# EAGLE design Incubator (EAGLE 6.4)
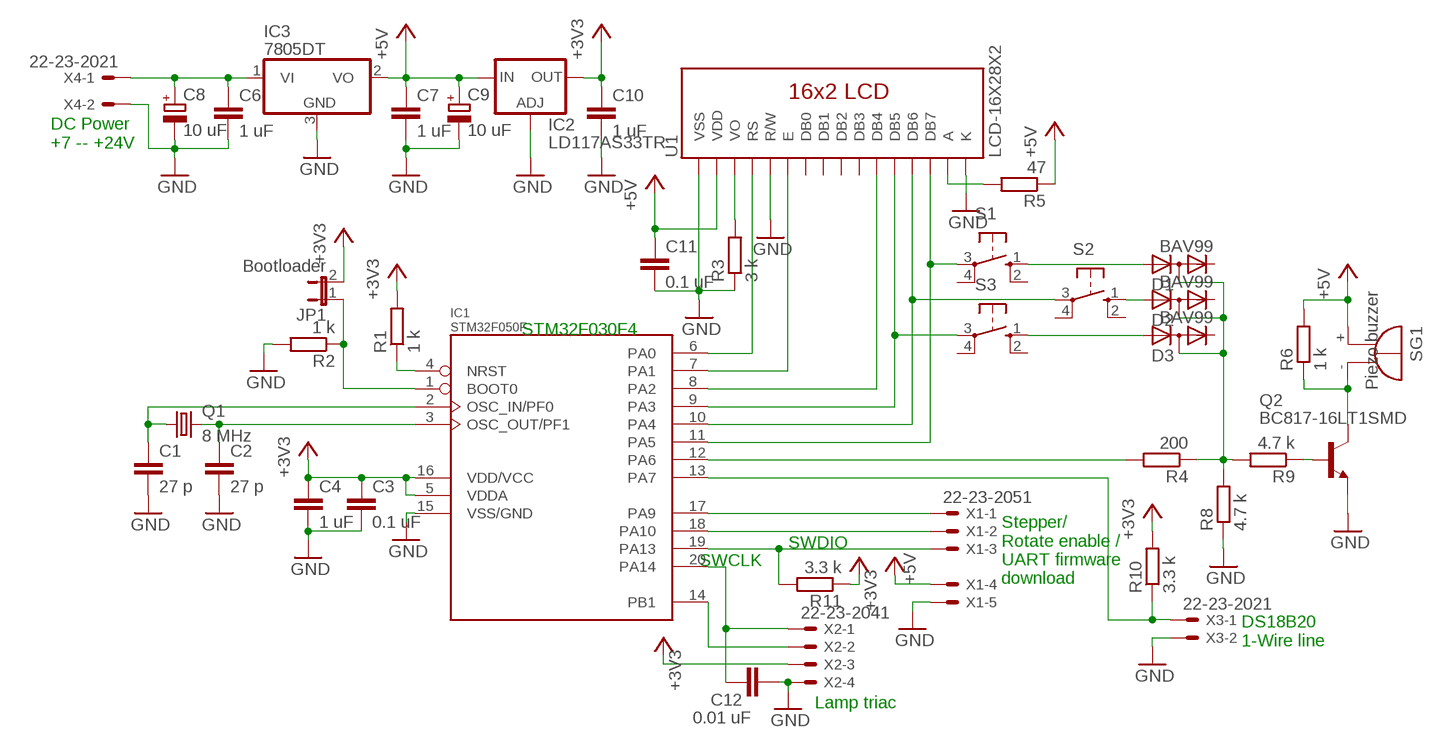
[diagram p0: schematic, sheet 1]

## Parts
C1  27 p  C-EUC0805  [C0805]
C2  27 p  C-EUC0805  [C0805]
C3  0.1 uF  C-EUC0805  [C0805]
C4  1 uF  C-EUC0805  [C0805]
C6  1 uF  C-EUC0805  [C0805]
C7  1 uF  C-EUC0805  [C0805]
C8  10 uF  CPOL-EUTT2D4L  [TT2D4L]
C9  10 uF  CPOL-EUTT2D4L  [TT2D4L]
C10  1 uF  C-EUC0805  [C0805]
C11  0.1 uF  C-EUC0805  [C0805]
C12  0.01 uF  C-EUC0805  [C0805]
D1  BAV99  BAV199  [SOT23]
D2  BAV99  BAV199  [SOT23]
D3  BAV99  BAV199  [SOT23]
IC1  STM32F050F  [TSSOP20]
IC2  LD117AS33TR  [SOT223]
IC3  7805DT  [TO252]
JP1  Bootloader  JP1E  [JP1]
Q1  8 MHz  CRYSTALHC49S  [HC49/S]
Q2  BC817-16LT1SMD  [SOT23-BEC]
R1  1 k  R-EU_R0805  [R0805]
R2  1 k  R-EU_R0805  [R0805]
R3  3 k  R-EU_R0805  [R0805]
R4  200  R-EU_R0805  [R0805]
R5  47  R-EU_R0805  [R0805]
R6  1 k  R-EU_R0805  [R0805]
R8  4.7 k  R-EU_R0805  [R0805]
R9  4.7 k  R-EU_R0805  [R0805]
R10  3.3 k  R-EU_R0805  [R0805]
R11  3.3 k  R-EU_R0805  [R0805]
S1  10-XX  [B3F-10XX]
S2  10-XX  [B3F-10XX]
S3  10-XX  [B3F-10XX]
SG1  Piezo buzzer  F/HMB  [F/HMB]
U1  LCD-16X28X2  [LCD-8X2]
X1  22-23-2051  [22-23-2051]
X2  22-23-2041  [22-23-2041]
X3  22-23-2021  [22-23-2021]
X4  22-23-2021  [22-23-2021]

## Nets
+3V3: C3.1 C4.1 C10.1 IC1.5(VDDA) IC1.16(VDD/VCC) IC2.4(OUT) JP1.2 R1.2 R10.2 R11.1 X2.3
+5V: C7.1 C9.+ C11.1 IC2.3(IN) IC3.2(VO) R5.1 R6.2 SG1.+ U1.2(VDD) X1.4
GND: C1.2 C2.2 C3.2 C4.2 C6.2 C7.2 C8.- C9.- C10.2 C11.2 C12.2 IC1.15(VSS/GND) IC2.1(ADJ) IC3.3(GND) Q2.E R2.2 R3.1 R8.1 U1.1(VSS) U1.5(R/W) U1.16(K) X1.5 X2.4 X3.2 X4.2
N$1: C2.1 IC1.3(OSC_OUT/PF1) Q1.2
N$2: C1.1 IC1.2(OSC_IN/PF0) Q1.1
N$3: IC1.4(NRST) R1.1
N$4: IC1.1(BOOT0) JP1.1 R2.1
N$5: IC1.17(PA9) X1.1
N$6: IC1.18(PA10) X1.2
N$7: IC1.19(PA13) R11.2 X1.3
N$8: C12.1 IC1.20(PA14) X2.1
N$9: IC1.6(PA0) U1.4(RS)
N$10: IC1.7(PA1) U1.6(E)
N$11: IC1.8(PA2) U1.11(DB4)
N$12: IC1.9(PA3) S3.3(P) U1.12(DB5)
N$13: IC1.10(PA4) S2.3(P) U1.13(DB6)
N$14: IC1.11(PA5) S1.3(P) U1.14(DB7)
N$15: R3.2 U1.3(VO)
N$16: D1.3(AC) D2.3(AC) D3.3(AC) R4.1 R8.2 R9.2
N$17: D1.1(A) S1.1(S)
N$18: D2.1(A) S2.1(S)
N$19: D3.1(A) S3.1(S)
N$21: Q2.B R9.1
N$22: Q2.C R6.1 SG1.-
N$23: IC1.14(PB1) X2.2
N$24: IC1.12(PA6) R4.2
N$25: IC1.13(PA7) R10.1 X3.1
N$26: C6.1 C8.+ IC3.1(VI) X4.1
N$27: R5.2 U1.15(A)
Unconnected: D1.2(C) D2.2(C) D3.2(C) S1.2(S1) S1.4(P1) S2.2(S1) S2.4(P1) S3.2(S1) S3.4(P1) U1.7(DB0) U1.8(DB1) U1.9(DB2) U1.10(DB3)

## Notes on the sheet
- DC Power
  +7 -- +24V
- STM32F030F4
- SWDIO
- SWCLK
- Stepper/
  Rotate enable /
  UART firmware 
  download
- DS18B20
  1-Wire line
- Lamp triac

## Library data of the parts
C1-C4 C6 C7 C10-C12 = rcl:C-EU: CAPACITOR, European symbol
C8 C9 = rcl:CPOL-EU: POLARIZED CAPACITOR, European symbol
D1-D3 = diode:BAV199: DIODE low-leakage double diode
IC1 = stm32 - Copy:STM32F050*: STM32F050xxF*
IC2 = v-reg:LD117A?*: Low drop fixed and adjustable positive voltage regulators 1 A Source: http://www.st.com/stonline/products/literature/ds/7194/ld1117axx.pdf
IC3 = linear:78*: Positive VOLTAGE REGULATOR Source: http://cache.national.com/ds/LM/LM78L05.pdf http://www.fairchildsemi.com/ds/LM/LM7805.pdf
JP1 = jumper:JP1E: JUMPER
Q1 = crystal:CRYSTAL: CRYSTAL; OC_FARNELL: 1667008; OC_NEWARK: unknown
Q2 = transistor-npn:BC817*: NPN Transistor
R1-R6 R8-R11 = resistor:R-EU_: RESISTOR, European symbol
S1-S3 = switch-omron:10-XX: OMRON SWITCH; MPN: B3F-1000; OC_FARNELL: 176432; OC_NEWARK: 36M3542
SG1 = buzzer:F/HMB: BUZZER Source: Buerklin; OC_FARNELL: unknown; OC_NEWARK: unknown
U1 = SparkFun-Displays:LCD-16X2: Standard text-only 16x2 parallel input LCD
X1 = con-molex:22-23-2051: .100" (2.54mm) Center Header - 5 Pin; MF: MOLEX; MPN: 22-23-2051; OC_FARNELL: 1462952; OC_NEWARK: 38C9178
X2 = con-molex:22-23-2041: .100" (2.54mm) Center Header - 4 Pin; MF: MOLEX; MPN: 22-23-2041; OC_FARNELL: 1462920; OC_NEWARK: 38C0355
X3 X4 = con-molex:22-23-2021: .100" (2.54mm) Center Header - 2 Pin; MF: MOLEX; MPN: 22-23-2021; OC_FARNELL: 1462926; OC_NEWARK: 25C3832

## Board
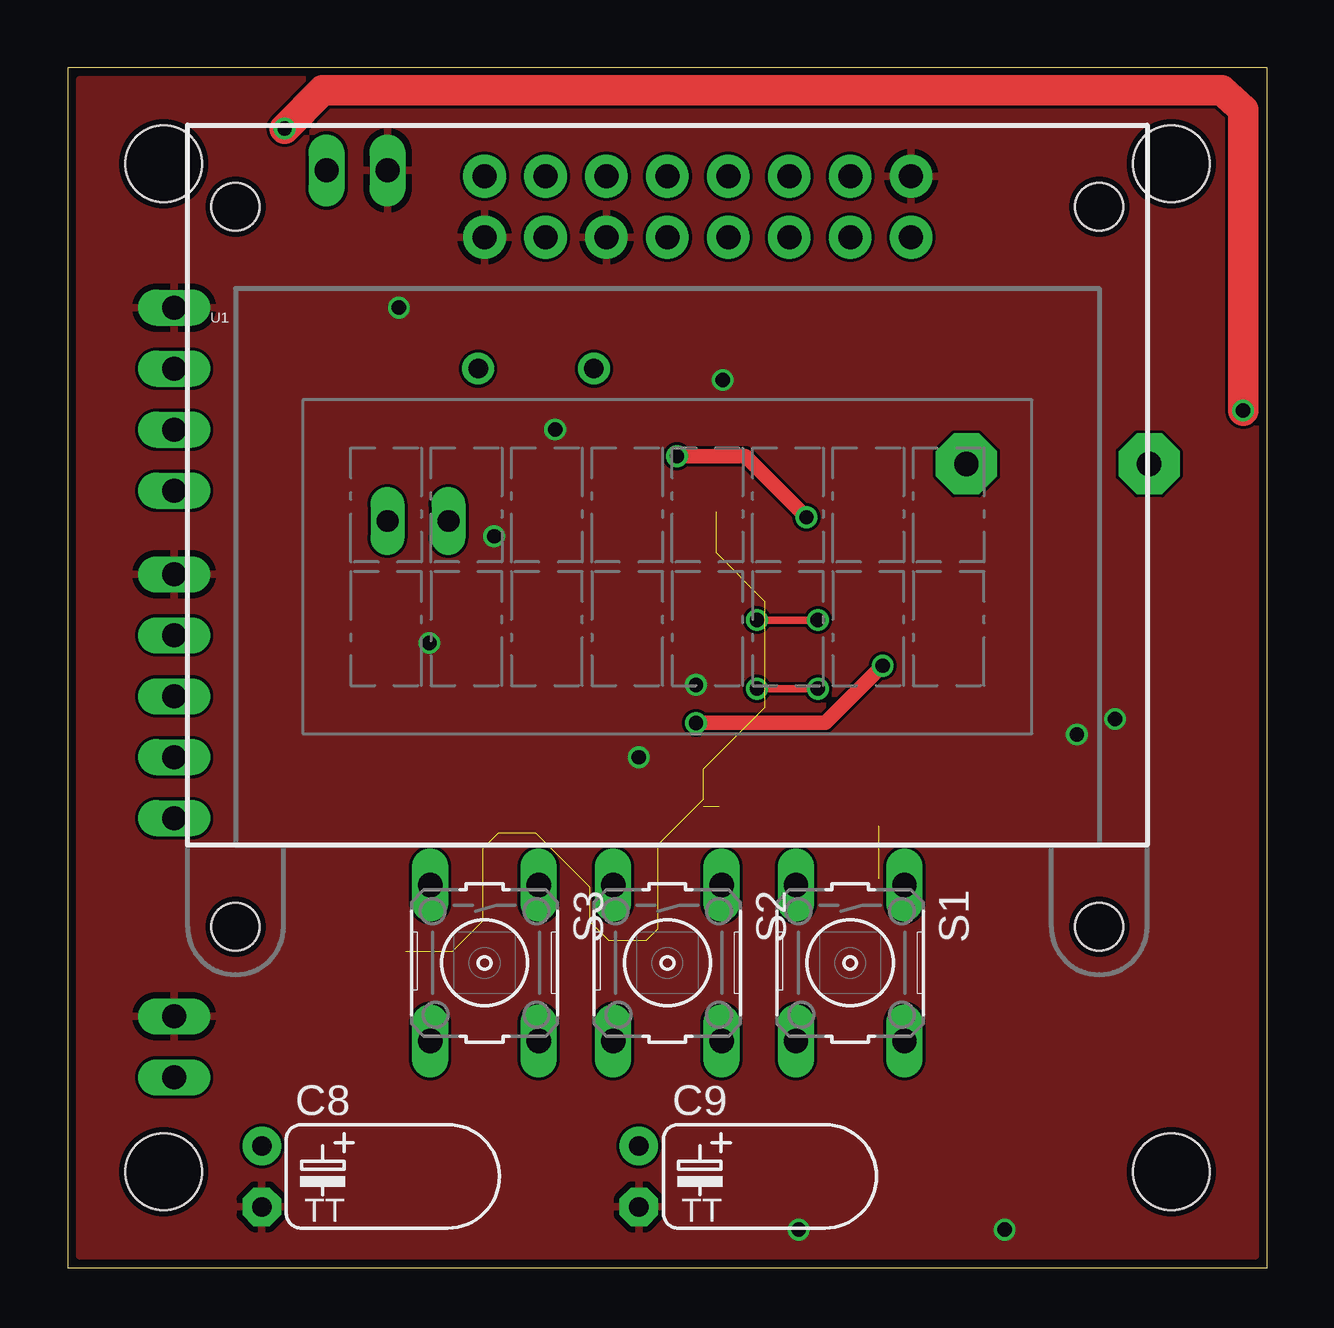
[diagram p1: board, top side]
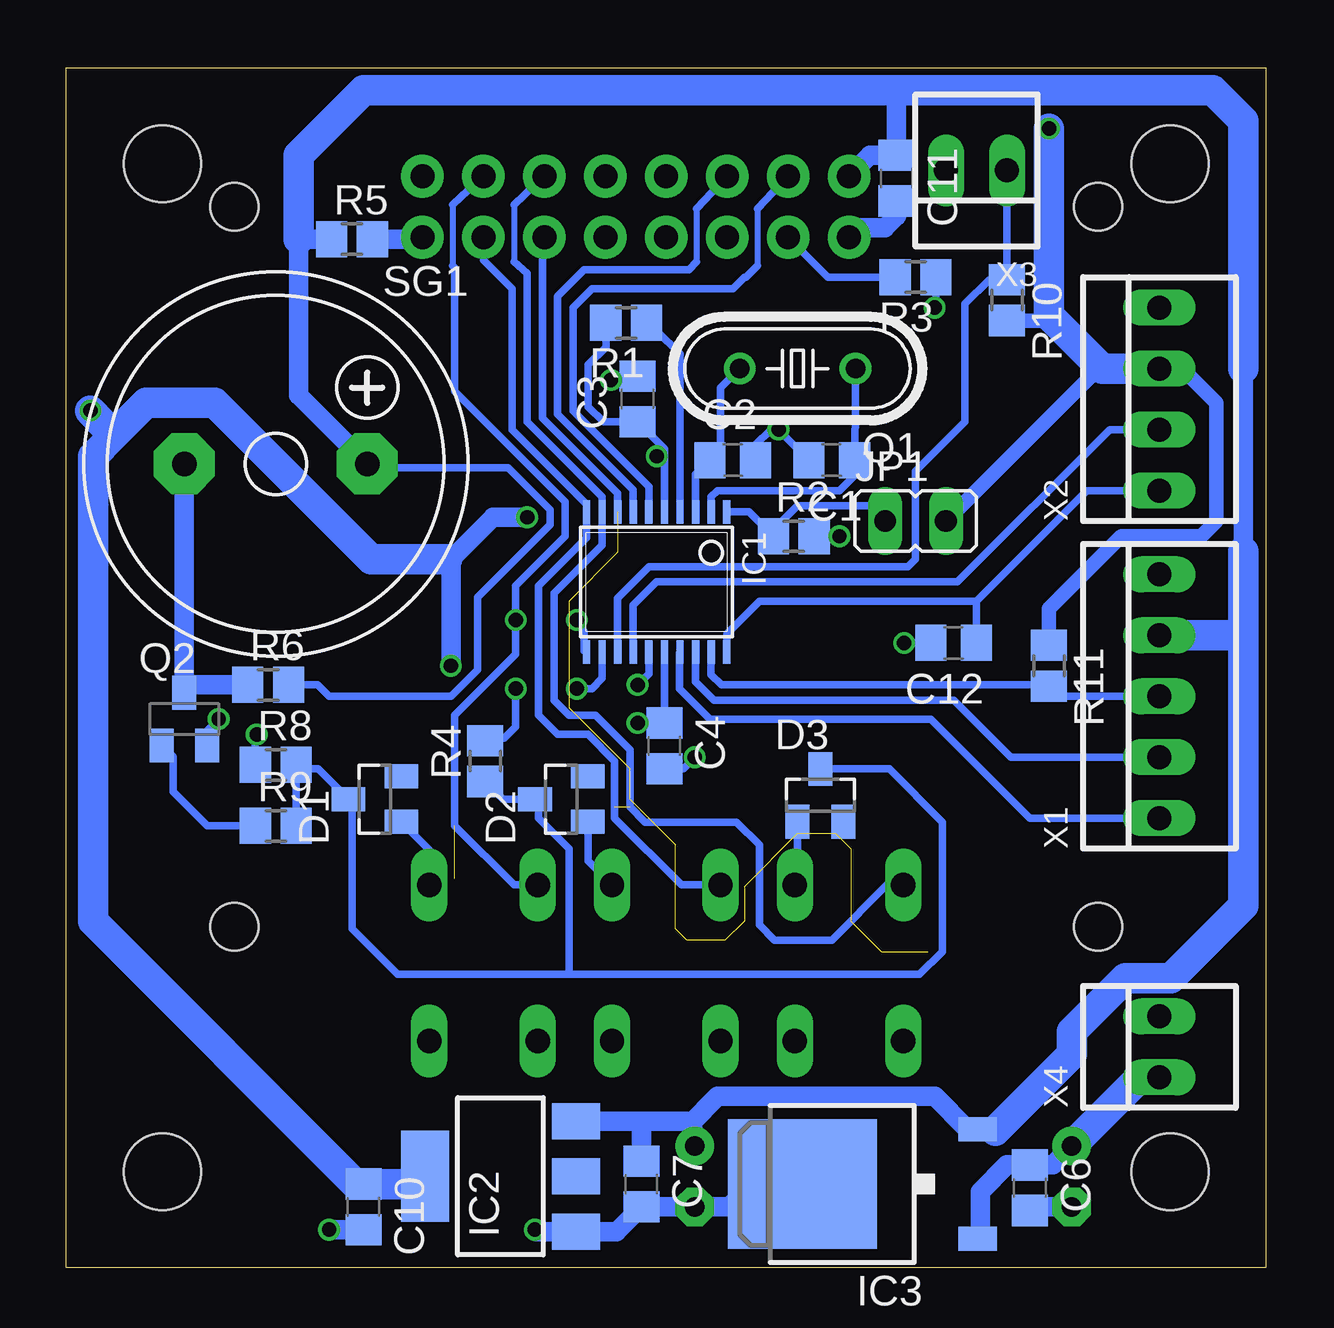
[diagram p2: board, bottom side, seen from below]

Size 50 x 50 mm. Coordinates in mm from the lower left corner, seen from the top.
Outline: 0,0 50,0 50,50 0,50 0,0
Copper layers (1*16): Top 0.035mm / dielectric 1.5mm / Bottom 0.035mm
Design rules "dirt_cheap_dirty_boards.v1": minimum track width 5mil, minimum drill 12mil, track to track 5mil, track to pad 5mil, pad to pad 5mil, via to via 5mil, smd to smd 0mil, copper to edge 10mil, drill to drill 10mil, minimum pad ring 10mil, minimum via ring 6mil, stop-mask expansion 2mil, vias tented up to drill 25mil, thermal gap 10mil
Holes 3.2 mm at 4,4 46,4 46,46 4,46

### Footprints (pad centres in the part's own frame; a part is rotated, then mirrored left to right if it is on the bottom)
C0805 = smd 1.3 x 1.5: 1 -0.95,0; 2 0.95,0
TT2D4L = drill 0.813 pad 1.6: + -1.27,0 | drill 0.813 pad 1.6 octagon: - 1.27,0
SOT23 = smd 1 x 1.4: 1 -0.95,-1.1; 2 0.95,-1.1; 3 0,1.1
TSSOP20 = smd 0.305 x 0.991: 1 -2.925,-2.918; 2 -2.275,-2.918; 3 -1.625,-2.918; 4 -0.975,-2.918; 5 -0.325,-2.918; 6 0.325,-2.918; 7 0.975,-2.918; 8 1.625,-2.918; 9 2.275,-2.918; 10 2.925,-2.918; 11 2.925,2.918; 12 2.275,2.918; 13 1.625,2.918; 14 0.975,2.918; 15 0.325,2.918; 16 -0.325,2.918; 17 -0.975,2.918; 18 -1.625,2.918; 19 -2.275,2.918; 20 -2.925,2.918
SOT223 = smd 1.5 x 2: 1 -2.3,-3.15; 2 0,-3.15; 3 2.3,-3.15 | smd 3.8 x 2: 4 0,3.15
TO252 = smd 1 x 1.6: 1 -2.28,-4.8; 2 2.28,-4.8 | smd 5.4 x 6.2: 3 0,2.5
JP1 = drill 0.914 long: 1 0,-1.27; 2 0,1.27
HC49/S = drill 0.813: 1 -2.413,0; 2 2.413,0
SOT23-BEC = smd 1 x 1.4: B -0.95,-1.1; C 0,1.1; E 0.95,-1.1
R0805 = smd 1.3 x 1.5: 1 -0.85,0; 2 0.85,0
B3F-10XX = drill 1.016 long: 1 -3.251,2.261; 2 3.251,2.261; 3 -3.251,-2.261; 4 3.251,-2.261
F/HMB = drill 1.016 pad 2.54 octagon: + 3.81,0; - -3.81,0
LCD-8X2 = drill 1 pad 1.778: 1 -7.62,13.73; 2 -7.62,16.27; 3 -5.08,13.73; 4 -5.08,16.27; 5 -2.54,13.73; 6 -2.54,16.27; 7 0,13.73; 8 0,16.27; 9 2.54,13.73; 10 2.54,16.27; 11 5.08,13.73; 12 5.08,16.27; 13 7.62,13.73; 14 7.62,16.27; 15 10.16,13.73; 16 10.16,16.27 | hole 2: 18,15; -18,15; -18,-15; 18,-15
22-23-2051 = drill 1 long: 1 -5.08,0; 2 -2.54,0; 3 0,0; 4 2.54,0; 5 5.08,0
22-23-2041 = drill 1 long: 1 -3.81,0; 2 -1.27,0; 3 1.27,0; 4 3.81,0
22-23-2021 = drill 1 long: 1 -1.27,0; 2 1.27,0

### Placement (x,y rotation side)
C1  18.1,33.66 180 bottom
C2  22.23,33.66 0 bottom
C3  26.19,36.2 90 bottom
C4  25.08,21.75 270 bottom
C6  9.84,3.33 270 bottom
C7  26.04,3.49 270 bottom
C8  8.1,3.81 270 top
C9  23.81,3.81 270 top
C10  37.62,2.54 270 bottom
C11  15.4,45.4 270 bottom
C12  13.02,26.04 180 bottom
D1  37.15,19.53 90 bottom
D2  29.37,19.53 90 bottom
D3  18.57,19.68 0 bottom
IC1  25.4,28.57 180 bottom
IC2  31.91,3.81 90 bottom
IC3  16.83,3.49 90 bottom
JP1  14.61,31.11 270 bottom
Q1  19.53,37.47 180 bottom
Q2  45.09,22.86 0 bottom
R1  26.67,39.37 180 bottom
R2  19.68,30.48 0 bottom
R3  14.61,41.27 180 bottom
R4  32.54,21.11 90 bottom
R5  38.1,42.86 0 bottom
R6  41.59,24.29 0 bottom
R8  41.27,20.95 0 bottom
R9  41.27,18.41 0 bottom
R10  10.79,40.32 270 bottom
R11  9.05,25.08 270 bottom
S1  32.62,12.7 270 top
S2  25,12.7 270 top
S3  17.38,12.7 270 top
SG1  41.27,33.5 0 bottom
U1  25,29.21 0 top
X1  4.45,23.81 90 bottom
X2  4.45,36.2 90 bottom
X3  12.06,45.72 180 bottom
X4  4.45,9.21 90 bottom

### Tracks (layer width: path | path; a pad name or v marks a point on that pad's centre or on a via)
+3V3  (via drill 0.6)
  Top 0.61: v26.19,22.7 31.59,22.7 v33.97,25.08 | v25.4,33.81 28.26,33.81 v30.8,31.27
  Top 1.27: v49,35.72 49,48.26 48.1,49.05 10.64,49.05 v9.05,47.47
  Bottom 0.305: 25.07,33.81 IC1.5 25.08,31.43 | 25.07,33.81 25.07,34.13 C3.1 26.36,35.24 27.62,35.24 28.26,35.88 28.26,37.62 27.52,38.36 R1.2 | 25.08,25.72 IC1.16 C4.1 v26.19,22.7 | v25.4,33.81 25.07,33.81
  Bottom 0.61: R11.1 9.05,27.46 6.03,30.48 2.7,30.48 2.06,31.11 2.06,36.04 3.49,37.47 X2.3 | R10.2 9.27,39.47 9.05,39.69 | JP1.2 6.91,37.54
  Bottom 0.813: C10.1 37.94,3.49 | 35.38,3.49 IC2.4 | v30.8,31.27 32.23,31.27 33.97,29.53 34.13,29.53 33.97,29.37 v33.97,25.08
  Bottom 1.27: 37.94,3.49 48.9,14.45 48.9,33.81 48.02,34.69 | 48.02,34.69 46.67,36.04 43.81,36.04 37.31,29.53 34.13,29.53 | C10.1 35.38,3.49 | v9.05,47.47 9.05,39.69 6.91,37.54 6.83,37.47 X2.3 | v49,35.72 48.02,34.69
+5V
  Bottom 0.305: SG1.+ 37.62,33.34 31.59,33.34 29.84,31.59 29.84,30.96 32.86,27.94 32.86,24.92 33.97,23.81 39.05,23.81 39.53,24.29 R6.2
  Bottom 0.813: 15.4,49.05 C11.1 16.51,46.35 U1.2 | SG1.+ 40.33,36.36 40.33,42.86 R5.1 | 11.27,5.71 11.97,5.71 IC3.2 12.44,5.77 13.81,7.14 22.86,7.14 23.99,6.01 | C9.+ 23.91,5.93 23.99,6.01 | IC2.3 26.04,6.11 | 26.04,6.11 24.09,6.11 23.99,6.01 | C7.1 26.04,6.11 | 0.95,37.47 0.95,29.84
  Bottom 1.27: 0.95,37.47 0.95,47.78 2.22,49.05 15.4,49.05 37.62,49.05 40.33,46.35 40.33,42.86 | 11.27,5.71 8.1,8.89 8.1,9.84 5.87,12.06 3.97,12.06 0.95,15.08 0.95,26.35 | X1.4 0.95,26.35 | 0.95,26.35 0.95,29.84
GND  (via drill 0.6)
  Bottom 0.305: C1.2 20,34.6 v20.32,34.92 20.64,34.92 21.27,34.29 C2.2 | v27.3,36.99 26.19,36.99 C3.2 | R2.2 v17.78,30.48 | R8.1 42.12,22.17 v42.07,22.23 | Q2.E 44.13,22.38 v43.66,22.86 | R3.1 13.76,40.06 v13.81,40.01 | IC1.15 25.73,24.76 v26.19,24.29 | C4.2 24.29,20.8 v23.81,21.27 | C12.2 v15.08,26.04
  Bottom 0.813: C11.2 15.4,43.81 15.88,43.34 16.98,43.34 U1.1 | C8.- 10,2.54 C6.2 | v30.48,1.59 30.4,1.51 IC2.1 27.07,1.51 C7.2 24.13,2.54 C9.- 22.38,2.54 21.43,3.49 IC3.3 | C10.2 v39.05,1.59
  pour Top: 0.5,49.5 49.5,49.5 49.5,0.5 0.5,0.5
N$1
  Bottom 0.305: IC1.3 23.77,33.05 C2.1 22.73,34.1 22.73,36.67 Q1.2
N$2
  Bottom 0.305: IC1.2 23.12,32.12 22.86,32.38 17.78,32.38 17.14,33.02 17.14,33.34 C1.1 17.14,33.97 17.14,34.92 17.11,35.05 Q1.1
N$3
  Bottom 0.305: IC1.4 24.43,38.08 25.4,39.05 25.46,39.05 R1.1
N$4
  Bottom 0.305: IC1.1 21.55,31.49 R2.1 20.54,30.74 19.53,31.75 16.51,31.75 JP1.1
N$5
  Bottom 0.305: X1.1 9.84,18.73 13.97,22.86 23.18,22.86 24.45,24.13 24.45,25.64 IC1.17
N$6
  Bottom 0.305: IC1.18 23.77,24.41 23.02,23.65 13.02,23.65 10.64,21.27 X1.2
N$7
  Bottom 0.305: IC1.19 23.12,24.71 22.7,24.29 9.11,24.29 R11.2 8.63,23.81 X1.3
N$8
  Bottom 0.305: 12.06,27.78 7.46,32.38 X2.1 | 12.06,27.78 21.11,27.78 22.48,26.42 IC1.20 | C12.1 12.06,27.78
N$9
  Bottom 0.254: 21.2,44.13 21.2,41.75
  Bottom 0.305: U1.4 21.2,44.13 | IC1.6 25.73,32.55 28.89,35.72 28.89,40.01 28.1,40.8 22.23,40.8 21.75,41.27 21.68,41.27 21.2,41.75
N$10
  Bottom 0.254: 23.74,44.13 23.74,41.91
  Bottom 0.305: U1.6 23.74,44.13 | IC1.7 26.38,32.41 29.53,35.56 29.53,40.48 28.42,41.59 24.06,41.59 23.74,41.91
N$11  (17 unrouted)
  Bottom 0.305: IC1.8 27.02,32.26 30.16,35.4 30.16,42.86 U1.11
N$12  (1 unrouted)
  Bottom 0.254: 31.35,44.29 31.35,41.91
  Bottom 0.305: 31.35,41.91 30.8,41.43 30.8,35.24 27.68,32.12 IC1.9 27.68,30.11 29.69,28.1 29.69,23.65 29.05,23.02 27.94,23.02 26.51,21.59 26.51,19.21 25.88,18.57 22.07,18.57 21.11,17.62 21.11,14.29 20.48,13.65 18.1,13.65 15.8,15.95 S3.3 | U1.12 31.35,44.29
N$13
  Bottom 0.305: U1.13 32.62,41.99 31.43,40.8 31.43,34.92 28.32,31.82 IC1.10 28.32,30.41 30.32,28.42 30.32,23.02 29.53,22.23 28.26,22.23 27.15,21.11 27.15,18.73 24.36,15.95 S2.3
N$14  (via drill 0.6)  (1 unrouted)
  Top 0.305: v28.73,26.99 v31.27,26.99
  Bottom 0.254: 33.9,44.29 33.9,41.75
  Bottom 0.305: U1.14 33.9,44.29 | v28.73,26.99 28.42,26.51 28.42,25.72 IC1.11 | 33.9,41.75 33.81,41.66 33.81,36.51 29.21,31.91 29.21,30.48 31.27,28.42 v31.27,26.99 31.27,25.56 33.81,23.02 33.81,18.41 31.35,15.95 S1.3
N$15
  Bottom 0.305: R3.2 18.25,41.27 U1.3
N$16
  Bottom 0.305: R9.2 R8.2 40.26,20.79 39.51,20.79 D1.3 38.1,19.38 38.1,14.13 36.2,12.22 29.05,12.22 | R4.1 32.54,19.86 | 29.05,12.22 14.45,12.22 13.49,13.18 13.49,18.57 15.71,20.79 D3.3 | 32.34,20.47 R4.1 | R4.1 31.81,19.53 D2.3 30.32,19.38 30.32,18.73 29.05,17.46 29.05,12.22
N$17
  Bottom 0.305: S1.1 34.88,17.41 D1.1
N$18
  Bottom 0.305: D2.1 28.27,16.96 S2.1
N$19
  Bottom 0.305: S3.1 19.52,15.95 D3.1
N$21
  Bottom 0.305: R9.1 44.13,18.41 45.56,19.84 45.56,21.29 Q2.B
N$22
  Bottom 0.305: 44.76,24.29 Q2.C 45.09,24.29
  Bottom 0.813: Q2.C SG1.- | R6.1 45.09,24.29
N$23
  Bottom 0.305: IC1.14 26.38,27.6 25.4,28.57 12.86,28.57 6.51,34.92 X2.2
N$24  (via drill 0.6)
  Top 0.305: v31.27,24.13 v28.73,24.13
  Bottom 0.305: v31.27,24.13 31.27,22.54 31.75,22.07 32.44,22.07 R4.2 | IC1.12 27.68,24.55 28.1,24.13 v28.73,24.13
N$25
  Bottom 0.305: X3.1 R10.1 11.53,41.17 12.54,40.16 12.54,35.24 14.61,33.18 14.61,29.53 14.92,29.21 25.72,29.21 27.02,27.9 IC1.13
N$26
  Bottom 0.813: X4.1 5.24,7.94 | C8.+ 8.89,4.29 C6.1 10.8,4.28 11.91,3.17 11.91,1.33 IC3.1
  Bottom 1.27: 5.24,7.94 C8.+
N$27
  Bottom 0.813: R5.2 35.24,42.86 U1.15